# Altium schematic sheet TIDA-01349_Inverter_VISense.SchDoc: InverterPowerStage_DCVoltagePhaseCurrentSense
size 431 x 279 mm; Date: Not shown in title block; ApprovedBy: Not shown in title block; CheckedBy: Not shown in title block; Author: Not shown in title block; CompanyName: Not shown in title block; Engineer: Not shown in title block; Organization: Not shown in title block; Address1: Not shown in title block; Address2: Not shown in title block; Address3: Not shown in title block; Address4: Not shown in title block; DocumentNumber: 1; Revision: Use project parameter SCH_Rev; SheetNumber: 3; SheetTotal: 4; PageSetup: Record=PageOptions|CenterHorizontal=True|CenterVertical=True|PrintScale=1.00|XCorrection=1.00|YCorrection=1.00|PrintKind=0|BorderSize=5000000|LeftOffset=0|BottomOffset=0|Orientation=2|PaperLength=1000|PaperWidth=1000|Scale=100|PaperSource=15|PrintQuality=600|MediaType=1|DitherType=10|PaperKind=Letter|PrintScaleMode=1; CurrentTime: Not shown in title block; CurrentDate: Not shown in title block; Time: Not shown in title block; DocumentFullPathAndName: Not shown in title block; DocumentName: Not shown in title block; ModifiedDate: Not shown in title block; ImagePath: Not shown in title block
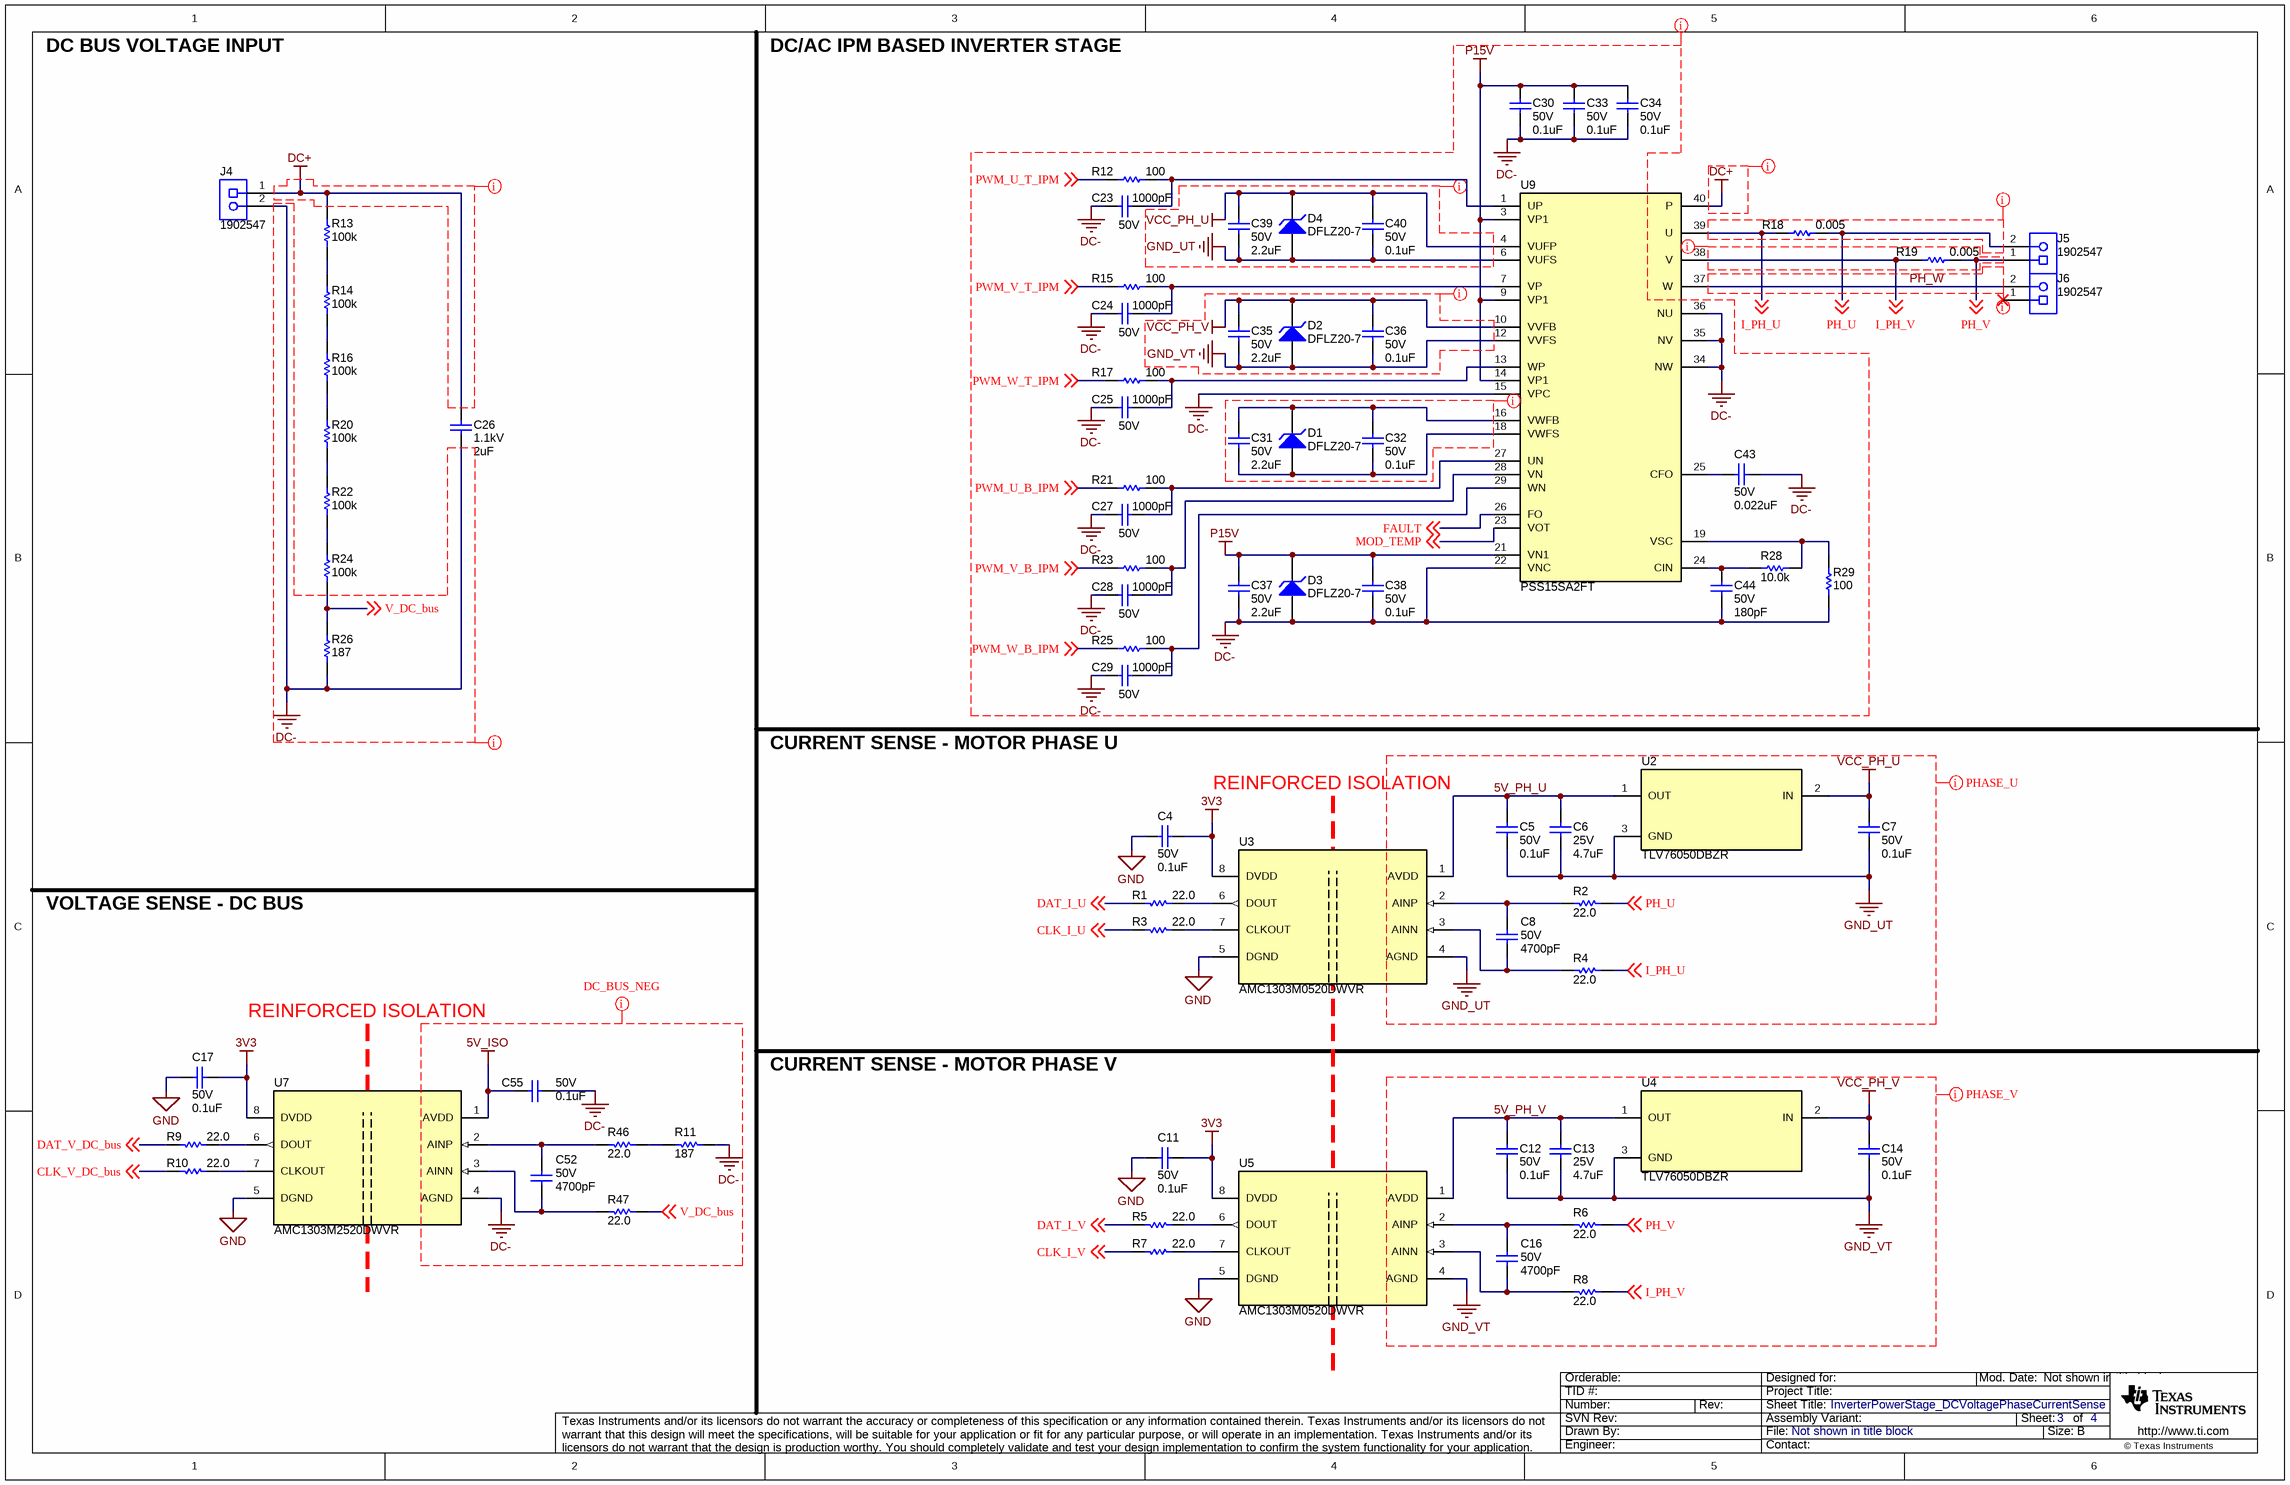
[diagram p0: TIDA-01349_Inverter_VISense.SchDoc]

## Parts
C4  VDC_V: 50V  ValueDisplayed: 0.1uF  [0603]  (hidden comment: C0603C104K5RACTU)
C5  VDC_V: 50V  ValueDisplayed: 0.1uF  [1206]  (hidden comment: C1206C104K5RACTU)
C6  VDC_V: 25V  ValueDisplayed: 4.7uF  [0805_HV]  (hidden comment: C2012X7R1E475K125AB)
C7  VDC_V: 50V  ValueDisplayed: 0.1uF  [0603]  (hidden comment: C0603C104K5RACTU)
C8  VDC_V: 50V  ValueDisplayed: 4700pF  [0603]  (hidden comment: C0603C472K5RACTU)
C11  VDC_V: 50V  ValueDisplayed: 0.1uF  [0603]  (hidden comment: C0603C104K5RACTU)
C12  VDC_V: 50V  ValueDisplayed: 0.1uF  [1206]  (hidden comment: C1206C104K5RACTU)
C13  VDC_V: 25V  ValueDisplayed: 4.7uF  [0805_HV]  (hidden comment: C2012X7R1E475K125AB)
C14  VDC_V: 50V  ValueDisplayed: 0.1uF  [0603]  (hidden comment: C0603C104K5RACTU)
C16  VDC_V: 50V  ValueDisplayed: 4700pF  [0603]  (hidden comment: C0603C472K5RACTU)
C17  VDC_V: 50V  ValueDisplayed: 0.1uF  [0603]  (hidden comment: C0603C104K5RACTU)
C23  VDC_V: 50V  ValueDisplayed: 1000pF  [0603]  (hidden comment: C0603C102J5GACTU)
C24  VDC_V: 50V  ValueDisplayed: 1000pF  [0603]  (hidden comment: C0603C102J5GACTU)
C25  VDC_V: 50V  ValueDisplayed: 1000pF  [0603]  (hidden comment: C0603C102J5GACTU)
C26  VDC_V: 1.1kV  ValueDisplayed: 2uF  [B32774_3150x2150x1250]  (hidden comment: B32774D0205K000)
C27  VDC_V: 50V  ValueDisplayed: 1000pF  [0603]  (hidden comment: C0603C102J5GACTU)
C28  VDC_V: 50V  ValueDisplayed: 1000pF  [0603]  (hidden comment: C0603C102J5GACTU)
C29  VDC_V: 50V  ValueDisplayed: 1000pF  [0603]  (hidden comment: C0603C102J5GACTU)
C30  VDC_V: 50V  ValueDisplayed: 0.1uF  [0603]  (hidden comment: C0603C104K5RACTU)
C31  VDC_V: 50V  ValueDisplayed: 2.2uF  [1206]  (hidden comment: UMK316B7225KL-T)
C32  VDC_V: 50V  ValueDisplayed: 0.1uF  [0603]  (hidden comment: C0603C104K5RACTU)
C33  VDC_V: 50V  ValueDisplayed: 0.1uF  [0603]  (hidden comment: C0603C104K5RACTU)
C34  VDC_V: 50V  ValueDisplayed: 0.1uF  [0603]  (hidden comment: C0603C104K5RACTU)
C35  VDC_V: 50V  ValueDisplayed: 2.2uF  [1206]  (hidden comment: UMK316B7225KL-T)
C36  VDC_V: 50V  ValueDisplayed: 0.1uF  [0603]  (hidden comment: C0603C104K5RACTU)
C37  VDC_V: 50V  ValueDisplayed: 2.2uF  [1206]  (hidden comment: UMK316B7225KL-T)
C38  VDC_V: 50V  ValueDisplayed: 0.1uF  [0603]  (hidden comment: C0603C104K5RACTU)
C39  VDC_V: 50V  ValueDisplayed: 2.2uF  [1206]  (hidden comment: UMK316B7225KL-T)
C40  VDC_V: 50V  ValueDisplayed: 0.1uF  [0603]  (hidden comment: C0603C104K5RACTU)
C43  VDC_V: 50V  ValueDisplayed: 0.022uF  [0603]  (hidden comment: C0603C223K5RACTU)
C44  VDC_V: 50V  ValueDisplayed: 180pF  [0603]  (hidden comment: C0603C181J5GACTU)
C52  VDC_V: 50V  ValueDisplayed: 4700pF  [0603]  (hidden comment: C0603C472K5RACTU)
C55  VDC_V: 50V  ValueDisplayed: 0.1uF  [0603]  (hidden comment: C0603C104K5RACTU)
D1  DFLZ20-7  [PowerDI123]
D2  DFLZ20-7  [PowerDI123]
D3  DFLZ20-7  [PowerDI123]
D4  DFLZ20-7  [PowerDI123]
J4  1902547  [Phoenix_1902547]
J5  1902547  [Phoenix_1902547]
J6  1902547  [Phoenix_1902547]
R1  ValueDisplayed: 22.0  [0603]  (hidden comment: RC0603FR-0722RL)
R2  ValueDisplayed: 22.0  [0603]  (hidden comment: RC0603FR-0722RL)
R3  ValueDisplayed: 22.0  [0603]  (hidden comment: RC0603FR-0722RL)
R4  ValueDisplayed: 22.0  [0603]  (hidden comment: RC0603FR-0722RL)
R5  ValueDisplayed: 22.0  [0603]  (hidden comment: RC0603FR-0722RL)
R6  ValueDisplayed: 22.0  [0603]  (hidden comment: RC0603FR-0722RL)
R7  ValueDisplayed: 22.0  [0603]  (hidden comment: RC0603FR-0722RL)
R8  ValueDisplayed: 22.0  [0603]  (hidden comment: RC0603FR-0722RL)
R9  ValueDisplayed: 22.0  [0603]  (hidden comment: RC0603FR-0722RL)
R10  ValueDisplayed: 22.0  [0603]  (hidden comment: RC0603FR-0722RL)
R11  ValueDisplayed: 187  [0603]  (hidden comment: CRCW0603187RFKEA)
R12  ValueDisplayed: 100  [0603]  (hidden comment: CRCW0603100RFKEA)
R13  ValueDisplayed: 100k  [1206]  (hidden comment: CRCW1206100KFKEA)
R14  ValueDisplayed: 100k  [1206]  (hidden comment: CRCW1206100KFKEA)
R15  ValueDisplayed: 100  [0603]  (hidden comment: CRCW0603100RFKEA)
R16  ValueDisplayed: 100k  [1206]  (hidden comment: CRCW1206100KFKEA)
R17  ValueDisplayed: 100  [0603]  (hidden comment: CRCW0603100RFKEA)
R18  ValueDisplayed: 0.005  [CSNL1206]  (hidden comment: CSNL1206FT5L00)
R19  ValueDisplayed: 0.005  [CSNL1206]  (hidden comment: CSNL1206FT5L00)
R20  ValueDisplayed: 100k  [1206]  (hidden comment: CRCW1206100KFKEA)
R21  ValueDisplayed: 100  [0603]  (hidden comment: CRCW0603100RFKEA)
R22  ValueDisplayed: 100k  [1206]  (hidden comment: CRCW1206100KFKEA)
R23  ValueDisplayed: 100  [0603]  (hidden comment: CRCW0603100RFKEA)
R24  ValueDisplayed: 100k  [1206]  (hidden comment: CRCW1206100KFKEA)
R25  ValueDisplayed: 100  [0603]  (hidden comment: CRCW0603100RFKEA)
R26  ValueDisplayed: 187  [0603]  (hidden comment: CRCW0603187RFKEA)
R28  ValueDisplayed: 10.0k  [0603]  (hidden comment: CRCW060310K0FKEA)
R29  ValueDisplayed: 100  [0603]  (hidden comment: CRCW0603100RFKEA)
R46  ValueDisplayed: 22.0  [0603]  (hidden comment: RC0603FR-0722RL)
R47  ValueDisplayed: 22.0  [0603]  (hidden comment: RC0603FR-0722RL)
U2  TLV76050DBZR  [DBZ0003A_N]
U3  AMC1303M0520DWVR  [DWV0008A]
U4  TLV76050DBZR  [DBZ0003A_N]
U5  AMC1303M0520DWVR  [DWV0008A]
U7  AMC1303M2520DWVR  [DWV0008A]
U9  PSS15SA2FT  [PSS15SA2FT]

## Nets
3V3: C4.1 C11.1 C17.1 U3.8(DVDD) U5.8(DVDD) U7.8(DVDD)
5V_ISO: C55.2 U7.1(AVDD)
DC+: C26.1 J4.1 R13.2 U9.40(P)
DC-: C23.2 C24.2 C25.2 C26.2 C27.2 C28.2 C29.2 C30.2 C33.2 C34.2 C37.2 C38.2 C43.1 C44.2 C55.1 D3.2(A) J4.2 R11.1 R26.1 R29.2 U7.4(AGND) U9.15(VPC) U9.22(VNC) U9.34(NW) U9.35(NV) U9.36(NU)
GND: C4.2 C11.2 C17.2 U3.5(DGND) U5.5(DGND) U7.5(DGND)
GND_UT: C5.1 C6.2 C7.1 C39.2 C40.2 D4.2(A) U2.3(GND) U3.4(AGND) U9.6(VUFS)
GND_VT: C12.1 C13.2 C14.1 C35.2 C36.2 D2.2(A) U4.3(GND) U5.4(AGND) U9.12(VVFS)
P15V: C30.1 C33.1 C34.1 C37.1 C38.1 D3.1(K) U9.3(VP1) U9.9(VP1) U9.14(VP1) U9.21(VN1)
VCC_PH_U: C7.2 C39.1 C40.1 D4.1(K) U2.2(IN) U9.4(VUFP)
VCC_PH_V: C14.2 C35.1 C36.1 D2.1(K) U4.2(IN) U9.10(VVFB)
5V_PH_U: C5.2 C6.1 U2.1(OUT) U3.1(AVDD)
5V_PH_V: C12.2 C13.1 U4.1(OUT) U5.1(AVDD)
CLK_I_U: R3.2 ; off-sheet CLK_I_U
CLK_I_V: R7.2 ; off-sheet CLK_I_V
CLK_V_DC_bus: R10.2 ; off-sheet CLK_V_DC_bus
DAT_I_U: R1.2 ; off-sheet DAT_I_U
DAT_I_V: R5.2 ; off-sheet DAT_I_V
DAT_V_DC_bus: R9.2 ; off-sheet DAT_V_DC_bus
FAULT: U9.26(FO) ; off-sheet FAULT
I_PH_U: R4.1 R18.1 U9.39(U) ; off-sheet I_PH_U
I_PH_V: R8.1 R19.1 U9.38(V) ; off-sheet I_PH_V
MOD_TEMP: U9.23(VOT) ; off-sheet MOD_TEMP
PH_U: J5.2 R2.1 R18.2 ; off-sheet PH_U
PH_V: J5.1 R6.1 R19.2 ; off-sheet PH_V
PH_W: J6.2 U9.37(W)
PWM_U_B_IPM: R21.1 ; off-sheet PWM_U_B_IPM
PWM_U_T_IPM: R12.1 ; off-sheet PWM_U_T_IPM
PWM_V_B_IPM: R23.1 ; off-sheet PWM_V_B_IPM
PWM_V_T_IPM: R15.1 ; off-sheet PWM_V_T_IPM
PWM_W_B_IPM: R25.1 ; off-sheet PWM_W_B_IPM
PWM_W_T_IPM: R17.1 ; off-sheet PWM_W_T_IPM
V_DC_bus: R24.1 R26.2 R47.1 ; off-sheet V_DC_bus
NetC8_1: C8.1 R2.2 U3.2(AINP)
NetC8_2: C8.2 R4.2 U3.3(AINN)
NetC16_1: C16.1 R6.2 U5.2(AINP)
NetC16_2: C16.2 R8.2 U5.3(AINN)
NetC23_1: C23.1 R12.2 U9.1(UP)
NetC24_1: C24.1 R15.2 U9.7(VP)
NetC25_1: C25.1 R17.2 U9.13(WP)
NetC27_1: C27.1 R21.2 U9.27(UN)
NetC28_1: C28.1 R23.2 U9.28(VN)
NetC29_1: C29.1 R25.2 U9.29(WN)
NetC31_1: C31.1 C32.1 D1.1(K) U9.16(VWFB)
NetC31_2: C31.2 C32.2 D1.2(A) U9.18(VWFS)
NetC43_2: C43.2 U9.25(CFO)
NetC44_1: C44.1 R28.1 U9.24(CIN)
NetC52_1: C52.1 R46.2 U7.2(AINP)
NetC52_2: C52.2 R47.2 U7.3(AINN)
NetR1_1: R1.1 U3.6(DOUT)
NetR3_1: R3.1 U3.7(CLKOUT)
NetR5_1: R5.1 U5.6(DOUT)
NetR7_1: R7.1 U5.7(CLKOUT)
NetR9_1: R9.1 U7.6(DOUT)
NetR10_1: R10.1 U7.7(CLKOUT)
NetR11_2: R11.2 R46.1
NetR13_1: R13.1 R14.2
NetR14_1: R14.1 R16.2
NetR16_1: R16.1 R20.2
NetR20_1: R20.1 R22.2
NetR22_1: R22.1 R24.2
NetR28_2: R28.2 R29.1 U9.19(VSC)

Not connected (* = marked no-connect by the designer): J6 1*

## Layout directives
net class DC_BUS_NEG: 5V_ISO, DC+, DC-, FAULT, GND_UT, GND_VT, I_PH_U, MOD_TEMP, P15V, PH_U, PWM_U_B_IPM, PWM_U_T_IPM, PWM_V_B_IPM, PWM_V_T_IPM, PWM_W_B_IPM, PWM_W_T_IPM, V_DC_bus, VCC_PH_U, VCC_PH_V
net class PHASE_U: 5V_PH_U, (no net found under the mark), DC+, DC-, FAULT, GND_UT, GND_VT, I_PH_U, MOD_TEMP, P15V, PH_U, PWM_U_B_IPM, PWM_U_T_IPM, PWM_V_B_IPM, PWM_V_T_IPM, PWM_W_B_IPM, PWM_W_T_IPM, VCC_PH_U, VCC_PH_V
net class PHASE_W: DC+, DC-, FAULT, GND_UT, GND_VT, I_PH_U, MOD_TEMP, P15V, PH_U, PH_W, PWM_U_B_IPM, PWM_U_T_IPM, PWM_V_B_IPM, PWM_V_T_IPM, PWM_W_B_IPM, PWM_W_T_IPM, VCC_PH_U, VCC_PH_V
net class PHASE_V: 5V_PH_V, (no net found under the mark), DC+, DC-, FAULT, GND_UT, GND_VT, I_PH_U, I_PH_V, MOD_TEMP, P15V, PH_U, PH_V, PWM_U_B_IPM, PWM_U_T_IPM, PWM_V_B_IPM, PWM_V_T_IPM, PWM_W_B_IPM, PWM_W_T_IPM, VCC_PH_U, VCC_PH_V
net class DC_BUS_POS: DC+, DC-, FAULT, GND_UT, GND_VT, I_PH_U, MOD_TEMP, P15V, PH_U, PWM_U_B_IPM, PWM_U_T_IPM, PWM_V_B_IPM, PWM_V_T_IPM, PWM_W_B_IPM, PWM_W_T_IPM, VCC_PH_U, VCC_PH_V

## Notes on the sheet
- DC BUS VOLTAGE INPUT
- DC/AC IPM BASED INVERTER STAGE
- CURRENT SENSE - MOTOR PHASE U
- REINFORCED ISOLATION
- VOLTAGE SENSE - DC BUS
- CURRENT SENSE - MOTOR PHASE V
- Drawn By:
- SVN Rev:
- Number:
- TID #:
- Orderable:
- Rev:
- Sheet Title:
- File:
- Project Title:
- Designed for:
- Assembly Variant:
- Mod. Date:
- Sheet:
- Size:
- of
- B
- http://www.ti.com
- Texas Instruments and/or its licensors do not warrant the accuracy or completeness of this specification or any information contained therein. Texas Instruments and/or its licensors do not warrant that this design will meet the specifications, will be suitable for your application or fit for any particular purpose, or will operate in an implementation. Texas Instruments and/or its licensors do not warrant that the design is production worthy. You should completely validate and test your design implementation to confirm the system functionality for your application.
- Engineer:
- Contact:
- © Texas Instruments

## Library data of the parts
C4 C7 C11 C14 C17 C30 C32-C34 C36 C38 C40 C55 = CMP-0006861-2: CAP, CERM, 0.1 uF, 50 V, +/- 10%, X7R, 0603; Manufacturer: Kemet; TaMin_C: -55°C; Polarized: N; SizeAreaWB_mm2: 4.68; Value1: Unknown; U/M: EA; Value: 0.1uF; TaMax_C: 125°C; SizeZ_mm: 1; SizeX_mm: 1.6; SizeY_mm: 0.8; SizeArea_mm2: 1.28; Cap_F: 100nF; AEC Category: Q200; Supplier Part Number 2: 80-C0603C104K5R; Publisher: Texas Instruments; Supplier 2: Mouser; Supplier Part Number 3: 1288255; TempCo: X7R; Supplier 3: Farnell; Published: 2008-06-19; RoHS: Y; MountType: SMT; Supplier 1: Digi-Key; PackageReference: 0603; Tolerance_%: 10%; Cap_Case: 0603; Value2: 50V; CompType: Capacitor; LatestRevisionDate: 2017-03-09; PartNumber: C0603C104K5RACTU; AEC Qualified: ?; ComponentLink1Description: Datasheet link; Supplier Part Number 1: 399-5089-1-ND; Technology: Ceramic; ComponentLink1URL: http://www.kemet.com/kemet/web/homepage/kechome.nsf/vapubfiles/F3102_Y5V.pdf/$file/F3102_Y5V.pdf
C5 C12 = CMP-0008586-2: CAP, CERM, 0.1 uF, 50 V, +/- 10%, X7R, 1206; Manufacturer: Kemet; TaMin_C: -55°C; ESR_ohm: 0.059; Polarized: N; SizeAreaWB_mm2: 10.92; Value1: 0.059 ohm; U/M: EA; Value: 0.1uF; TaMax_C: 125°C; SizeZ_mm: 1.35; SizeX_mm: 3.2; SizeY_mm: 1.6; SizeArea_mm2: 5.12; Cap_F: 100nF; IRMS_A: 1.2A; AEC Category: Q200; Supplier Part Number 2: 70K9167; Publisher: Texas Instruments; Supplier 2: Newark; Supplier Part Number 3: 80-C1206C104K5R; TempCo: X7R; Supplier 3: Mouser; Published: 2008-06-19; RoHS: Y; MountType: SMT; Supplier 1: Digi-Key; PackageReference: 1206; Tolerance_%: 10%; Cap_Case: 1206; Value2: 50V; CompType: Capacitor; LatestRevisionDate: 2017-03-09; PartNumber: C1206C104K5RACTU; AEC Qualified: ?; ComponentLink1Description: Datasheet link; Supplier Part Number 1: 399-1249-1-ND; Technology: Ceramic; ComponentLink1URL: http://www.kemet.com/kemet/web/homepage/kechome.nsf/file/Partial%20Copy%20-%20Ceramic%20Surface%20Mount%20Capacitors/$file/F3102_CE.pdf
C6 C13 = CMP-0007870-2: CAP, CERM, 4.7 uF, 25 V, +/- 10%, X7R, 0805; Manufacturer: TDK; TaMin_C: -55°C; Polarized: N; SizeAreaWB_mm2: 6.75; Value1: Unknown; U/M: EA; Value: 4.7uF; TaMax_C: 125°C; SizeZ_mm: 1.45; SizeX_mm: 2; SizeY_mm: 1.25; Cap_Case: 0805; SizeArea_mm2: 2.5; Cap_F: 4.7µF; AEC Category: Q200; Supplier Part Number 2: 04X3287; Publisher: Texas Instruments; Supplier 2: Newark; Supplier Part Number 3: 810-C2012X7R1E475K; TempCo: X7R; Supplier 3: Mouser; Published: 2008-06-19; RoHS: Y; MountType: SMT; Supplier 1: Digi-Key; PackageReference: 0805; Tolerance_%: 10%; Value2: 25V; CompType: Capacitor; LatestRevisionDate: 2017-03-09; PartNumber: C2012X7R1E475K125AB; AEC Qualified: N; ComponentLink1Description: Datasheet link; AEC Grade: N/A; Supplier Part Number 1: 445-5972-1-ND; Technology: Ceramic; ComponentLink1URL: https://product.tdk.com/info/en/catalog/datasheets/mlcc_commercial_general_en.pdf
C8 C16 C52 = CMP-0006943-2: CAP, CERM, 4700 pF, 50 V, +/- 10%, X7R, 0603; Manufacturer: Kemet; TaMin_C: -55°C; Polarized: N; SizeAreaWB_mm2: 4.68; Value1: Unknown; U/M: EA; Value: 4700pF; TaMax_C: 125°C; SizeZ_mm: 1; SizeX_mm: 1.6; SizeY_mm: 0.8; SizeArea_mm2: 1.28; Cap_F: 4.7nF; AEC Category: Q200; Supplier Part Number 2: 80-C0603C472K5R; Publisher: Texas Instruments; Supplier 2: Mouser; Supplier Part Number 3: 1414642; TempCo: X7R; Supplier 3: Farnell; Published: 2008-06-19; RoHS: Y; MountType: SMT; Supplier 1: Digi-Key; PackageReference: 0603; Tolerance_%: 10%; Cap_Case: 0603; Value2: 50V; CompType: Capacitor; LatestRevisionDate: 2017-03-09; PartNumber: C0603C472K5RACTU; AEC Qualified: ?; ComponentLink1Description: Datasheet link; Supplier Part Number 1: 399-1087-1-ND; Technology: Ceramic; ComponentLink1URL: http://www.kemet.com/kemet/web/homepage/kechome.nsf/vapubfiles/F3102_Y5V.pdf/$file/F3102_Y5V.pdf
C23-C25 C27-C29 = CMP-0006843-2: CAP, CERM, 1000 pF, 50 V, +/- 5%, C0G/NP0, 0603; Manufacturer: Kemet; TaMin_C: -55°C; Polarized: N; SizeAreaWB_mm2: 4.68; Value1: Unknown; U/M: EA; Value: 1000pF; TaMax_C: 125°C; SizeZ_mm: 1; SizeX_mm: 1.6; SizeY_mm: 0.8; SizeArea_mm2: 1.28; Cap_F: 1nF; AEC Category: Q200; Supplier Part Number 2: 80-C0603C102J5G; Publisher: Texas Instruments; Supplier 2: Mouser; Supplier Part Number 3: 1414605; TempCo: C0G/NP0; Supplier 3: Farnell; Published: 2008-06-19; RoHS: Y; MountType: SMT; Supplier 1: Digi-Key; PackageReference: 0603; Tolerance_%: 5%; Cap_Case: 0603; Value2: 50V; CompType: Capacitor; LatestRevisionDate: 2017-03-09; PartNumber: C0603C102J5GACTU; AEC Qualified: ?; ComponentLink1Description: Datasheet link; Supplier Part Number 1: 399-3293-1-ND; Technology: Ceramic; ComponentLink1URL: http://www.kemet.com/kemet/web/homepage/kechome.nsf/vapubfiles/F3102_Y5V.pdf/$file/F3102_Y5V.pdf
C26 = CMP-0012356-2: CAP, Film, 2 uF, 1100 V, +/- 10%, 0.011 ohm, TH; Manufacturer: TDK; TaMin_C: -40°C; ESR_ohm: 0.011; Polarized: N; SizeAreaWB_mm2: 485.75; U/M: EA; Value: 2uF; TaMax_C: 105°C; SizeZ_mm: 21.5; SizeX_mm: 31.5; SizeY_mm: 12.5; Cap_Case: 31.5x21.5x12.5mm; Value2: 1100V; SizeArea_mm2: 393.75; Cap_F: 2µF; IRMS_A: 3.5A; AEC Category: Q200; Supplier Part Number 2: 42Y0105; Publisher: Texas Instruments; Supplier 2: Newark; Supplier Part Number 3: 871-B32774D205K; Supplier 3: Mouser; RoHS: Y; Value1: 0.011 ohm; MountType: TH; Supplier 1: Digi-Key; PackageReference: 31.5x21.5x12.5mm; Tolerance_%: 10%; CompType: Capacitor; LatestRevisionDate: 2017-03-09; PartNumber: B32774D0205K000; AEC Qualified: N; Series: B32774; ComponentLink1Description: Datasheet link; AEC Grade: N/A; Supplier Part Number 1: 495-4482-ND; Technology: Film; ComponentLink1URL: https://product.tdk.com/search-template/en/documents/data_sheet/20/20/db/fc_2009/MKP_B32774_778.pdf
C31 C37 C39 = CMP-0009028-2: CAP, CERM, 2.2 uF, 50 V, +/- 10%, X7R, 1206; Manufacturer: Taiyo Yuden; TaMin_C: -55°C; Polarized: N; SizeAreaWB_mm2: 10.92; Value1: Unknown; U/M: EA; Value: 2.2uF; TaMax_C: 125°C; SizeZ_mm: 1.35; SizeX_mm: 3.2; SizeY_mm: 1.6; SizeArea_mm2: 5.12; Cap_F: 2.2µF; AEC Category: Q200; Supplier Part Number 2: 47T1713; Publisher: Texas Instruments; Supplier 2: Newark; Supplier Part Number 3: 963-UMK316B7225KL-T; TempCo: X7R; Supplier 3: Mouser; Published: 2008-06-19; RoHS: Y; MountType: SMT; Supplier 1: Digi-Key; PackageReference: 1206; Tolerance_%: 10%; Cap_Case: 1206; Value2: 50V; CompType: Capacitor; LatestRevisionDate: 2017-03-09; PartNumber: UMK316B7225KL-T; AEC Qualified: ?; ComponentLink1Description: Datasheet link; Supplier Part Number 1: 587-2911-1-ND; Technology: Ceramic; ComponentLink1URL: http://www.yuden.co.jp/or/product/category/capacitor/UMK316B7225KL-T.pdf
C35 = CMP-0009028-2: CAP, CERM, 2.2 uF, 50 V, +/- 10%, X7R, 1206; Manufacturer: Taiyo Yuden; TaMin_C: -55°C; Polarized: N; SizeAreaWB_mm2: 10.92; Value1: Unknown; U/M: EA; Value: 2.2uF; TaMax_C: 125°C; SizeZ_mm: 1.35; SizeX_mm: 3.2; SizeY_mm: 1.6; SizeArea_mm2: 5.12; CompType: Capacitor; Cap_F: 2.2µF; AEC Category: Q200; Supplier Part Number 2: 47T1713; Publisher: Texas Instruments; Supplier 2: Newark; Supplier Part Number 3: 963-UMK316B7225KL-T; TempCo: X7R; Supplier 3: Mouser; Published: 2008-06-19; RoHS: Y; MountType: SMT; Supplier 1: Digi-Key; PackageReference: 1206; Tolerance_%: 10%; Cap_Case: 1206; Value2: 50V; LatestRevisionDate: 2017-03-09; PartNumber: UMK316B7225KL-T; AEC Qualified: ?; ComponentLink1Description: Datasheet link; Supplier Part Number 1: 587-2911-1-ND; Technology: Ceramic; ComponentLink1URL: http://www.yuden.co.jp/or/product/category/capacitor/UMK316B7225KL-T.pdf
C43 = CMP-0006901-2: CAP, CERM, 0.022 uF, 50 V, +/- 10%, X7R, 0603; Manufacturer: Kemet; TaMin_C: -55°C; Polarized: N; Value1: Unknown; U/M: EA; TaMax_C: 125°C; SizeAreaWB_mm2: 4.68; SizeZ_mm: 1; SizeX_mm: 1.6; SizeY_mm: 0.8; SizeArea_mm2: 1.28; Cap_F: 22nF; AEC Category: Q200; Supplier Part Number 2: 80-C0603C223K5R; Publisher: Texas Instruments; Supplier 2: Mouser; Supplier Part Number 3: 1414625; TempCo: X7R; Supplier 3: Farnell; Published: 2008-06-19; RoHS: Y; MountType: SMT; Value: 0.022uF; Supplier 1: Digi-Key; PackageReference: 0603; Tolerance_%: 10%; Cap_Case: 0603; Value2: 50V; CompType: Capacitor; LatestRevisionDate: 2017-03-09; PartNumber: C0603C223K5RACTU; AEC Qualified: ?; ComponentLink1Description: Datasheet link; Supplier Part Number 1: 399-1280-1-ND; Technology: Ceramic; ComponentLink1URL: http://www.kemet.com/kemet/web/homepage/kechome.nsf/vapubfiles/F3102_Y5V.pdf/$file/F3102_Y5V.pdf
C44 = CMP-0006888-2: CAP, CERM, 180 pF, 50 V, +/- 5%, C0G/NP0, 0603; Manufacturer: Kemet; TaMin_C: -55°C; Polarized: N; SizeAreaWB_mm2: 4.68; Value1: Unknown; U/M: EA; Value: 180pF; TaMax_C: 125°C; SizeZ_mm: 1; SizeX_mm: 1.6; SizeY_mm: 0.8; SizeArea_mm2: 1.28; AEC Category: Q200; Supplier Part Number 2: 80-C0603C181J5G; Publisher: Texas Instruments; Supplier 2: Mouser; Supplier Part Number 3: 1414621; TempCo: C0G/NP0; Supplier 3: Farnell; Published: 2008-06-19; RoHS: Y; MountType: SMT; Supplier 1: Digi-Key; PackageReference: 0603; Tolerance_%: 5%; Cap_Case: 0603; Value2: 50V; CompType: Capacitor; LatestRevisionDate: 2017-03-09; PartNumber: C0603C181J5GACTU; AEC Qualified: ?; Cap_F: 180pF; ComponentLink1Description: Datasheet link; Supplier Part Number 1: 399-1064-1-ND; Technology: Ceramic; ComponentLink1URL: http://www.kemet.com/kemet/web/homepage/kechome.nsf/vapubfiles/F3102_Y5V.pdf/$file/F3102_Y5V.pdf
D1-D4 = CMP-0005414-2: Diode, Zener, 20 V, 1 W, PowerDI123; Manufacturer: Diodes Inc.; Power_W: 1W; SizeAreaWB_mm2: 13.066; Vz_V: 20V; RJA_CperW: 110; U/M: EA; Value: 20V; SizeZ_mm: 0.98; SizeX_mm: 3.7; SizeY_mm: 1.78; SizeArea_mm2: 6.586; AEC Category: Q101; Supplier Part Number 2: 621-DFLZ20-7; Publisher: Texas Instruments; Supplier 2: Mouser; Published: 2008-10-08; RoHS: Y; Value1: 1W; MountType: SMT; Supplier 1: Digi-Key; LatestRevisionNote: Updated Supplier Data; PackageReference: PowerDI123; CompType: Zener; LatestRevisionDate: 2017-03-09; PartNumber: DFLZ20-7; AEC Qualified: ?; ComponentLink1Description: Datasheet link; Supplier Part Number 1: DFLZ20DICT-ND; ComponentLink1URL: http://www.diodes.com/datasheets/ds30464.pdf
J4-J6 = CMP-0055527-1: Terminal Block, 9.52mm, 2x1, R/A, TH; Manufacturer: Phoenix Contact; Cert_VDE: Y; CNHeader: FALSE; Current_A: 32A; Gender: Female; Voltage_V: 1kV; Row_Count: 1; Pitch_mm: 9.52; CT: TRUE; ComponentLink1URL: https://www.phoenixcontact.com/online/portal/in?uri=pxc-oc-itemdetail:pid=1902547&library=inen&tab=1&requestType=product&product; Supplier Part Number 2: 651-1902547; Publisher: Texas Instruments; Supplier 2: Mouser; Color: Green; RoHS: Y; MountType: TH; Supplier 1: Digi-Key; PackageReference: Terminal Block, 2x1, Pitch 9.52mm; PinCount: 2; CompType: Terminal Block; LatestRevisionDate: 26/05/2017; PartNumber: 1902547; Orientation: R/A; ComponentLink1Description: Datasheet URL; Supplier Part Number 1: 277-5951-ND; Cert_UL: Y
R1-R10 R46 R47 = CMP-0022928-1: RES, 22.0, 1%, 0.1 W, 0603; Manufacturer: Yageo America; Power_W: 100mW; TempCo: 200 ppm/C; Value_Code: 22R0; U/M: EA; Value: 22.0; Res_ohm: 22; SizeX_mm: 1.6; SizeY_mm: 0.8; SizeZ_mm: 1; Value2: 0.1W; SizeArea_mm2: 1.28; VDC_V: 150V; AEC Category: Q200; ComponentLink1URL: http://www.yageo.com/pdf/Pu-RC0603_51_PbFree_L_2.pdf; Supplier Part Number 2: 603-RC0603FR-0722RL; Publisher: Texas Instruments; Supplier 2: Mouser; Supplier Part Number 3: 9238280; Supplier 3: Farnell; Published: 2008-06-26; RoHS: Y; Value1: 1%; MountType: SMT; Supplier 1: Digi-Key; PackageReference: 0603; Tolerance_%: 1%; CompType: Resistor; LatestRevisionDate: 2017-03-09; PartNumber: RC0603FR-0722RL; AEC Qualified: ?; ComponentLink1Description: Datasheet link; Supplier Part Number 1: 311-22.0HRCT-ND; Technology: Thick Film
R11 R26 = CMP-0022096-3: RES, 187, 1%, 0.1 W, 0603; Manufacturer: Vishay-Dale; Power_W: 100mW; TempCo: 100 ppm/C; Value_Code: 187R; U/M: EA; Value: 187; EIA_Code: E96; SizeX_mm: 1.6; SizeY_mm: 0.8; SizeZ_mm: 1; Value2: 0.1W; SizeArea_mm2: 1.28; VDC_V: 75V; AEC Category: Q200; Supplier Part Number 2: 71-CRCW0603-187-E3; Publisher: Texas Instruments; Supplier 2: Mouser; Supplier Part Number 3: 1897290; Supplier 3: Farnell; Published: 2008-06-26; RoHS: Y; Value1: 1%; MountType: SMT; Supplier 1: Digi-Key; PackageReference: 0603; Tolerance_%: 1%; Res_ohm: 187; CompType: Resistor; LatestRevisionDate: 2017-03-09; PartNumber: CRCW0603187RFKEA; AEC Qualified: ?; ComponentLink1Description: Datasheet link; Supplier Part Number 1: 541-187HCT-ND; Technology: Thick Film; ComponentLink1URL: http://www.vishay.com/docs/20035/dcrcwe3.pdf
R12 R15 R17 R21 R23 R25 R29 = CMP-0021991-2: RES, 100, 1%, 0.1 W, 0603; Manufacturer: Vishay-Dale; Power_W: 100mW; TempCo: 100 ppm/C; Value_Code: 100R; U/M: EA; Value: 100; EIA_Code: E96; SizeX_mm: 1.6; SizeY_mm: 0.8; SizeZ_mm: 1; Value2: 0.1W; SizeArea_mm2: 1.28; VDC_V: 75V; AEC Category: Q200; Supplier Part Number 2: 52K8078; Publisher: Texas Instruments; Supplier 2: Newark; Supplier Part Number 3: 71-CRCW0603-100-E3; Supplier 3: Mouser; Published: 2008-06-26; RoHS: Y; Value1: 1%; MountType: SMT; Supplier 1: Digi-Key; PackageReference: 0603; Tolerance_%: 1%; Res_ohm: 100; CompType: Resistor; LatestRevisionDate: 2017-03-09; PartNumber: CRCW0603100RFKEA; AEC Qualified: ?; ComponentLink1Description: Datasheet link; Supplier Part Number 1: 541-100HCT-ND; Technology: Thick Film; ComponentLink1URL: http://www.vishay.com/docs/20035/dcrcwe3.pdf
R13 R14 R16 R20 R22 R24 = CMP-0016568-2: RES, 100 k, 1%, 0.25 W, 1206; Manufacturer: Vishay-Dale; Power_W: 250mW; TempCo: 100 ppm/C; U/M: EA; Value: 100k; EIA_Code: E96; SizeX_mm: 3.2; SizeY_mm: 1.6; SizeZ_mm: 1.35; Value2: 0.25W; SizeArea_mm2: 5.12; VDC_V: 200V; AEC Category: Q200; Supplier Part Number 2: 53K1920; Publisher: Texas Instruments; Supplier 2: Newark; Supplier Part Number 3: 71-CRCW1206-100K-E3; Supplier 3: Mouser; Published: 2008-06-26; Value_Code: 100k; RoHS: Y; Value1: 1%; MountType: SMT; Supplier 1: Digi-Key; PackageReference: 1206; Tolerance_%: 1%; Res_ohm: 100k; CompType: Resistor; LatestRevisionDate: 2017-03-09; PartNumber: CRCW1206100KFKEA; AEC Qualified: ?; ComponentLink1Description: Datasheet link; Supplier Part Number 1: 541-100KFCT-ND; Technology: Thick Film; ComponentLink1URL: http://www.vishay.com/docs/20035/dcrcwe3.pdf
R18 R19 = CMP-0065336-2: RES, 0.005, 1%, 1 W, 1206; Manufacturer: Stackpole Electronics Inc; Power_W: 1W; TempCo: 50 ppm/C; Value_Code: 5L000; U/M: EA; Value: 0.005; EIA_Code: E96; Res_ohm: 5m; SizeX_mm: 3.2; SizeY_mm: 1.6; SizeZ_mm: 0.9; SizeArea_mm2: 5.12; AEC Qualified: N; AEC Category: Q200; Publisher: Texas Instruments; Published: 2008-06-26; RoHS: Y; Value1: 1%; MountType: SMT; Supplier 1: Digi-Key; PackageReference: 1206; Tolerance_%: 1%; Value2: 1W; CompType: Resistor; LatestRevisionDate: 2017-06-05; PartNumber: CSNL1206FT5L00; ComponentLink1Description: Datasheet link; AEC Grade: N/A; Supplier Part Number 1: CSNL1206FT5L00CT-ND; Technology: Metal Foil; ComponentLink1URL: https://www.seielect.com/Catalog/SEI-csnl.pdf
R28 = CMP-0021998-2: RES, 10.0 k, 1%, 0.1 W, 0603; Manufacturer: Vishay-Dale; Power_W: 100mW; TempCo: 100 ppm/C; Value_Code: 10k0; U/M: EA; Value: 10.0k; EIA_Code: E96; Res_ohm: 10k; SizeX_mm: 1.6; SizeY_mm: 0.8; SizeZ_mm: 1; Value2: 0.1W; SizeArea_mm2: 1.28; VDC_V: 75V; AEC Category: Q200; Supplier Part Number 2: 52K8062; Publisher: Texas Instruments; Supplier 2: Newark; Supplier Part Number 3: 71-CRCW0603-10K-E3; Supplier 3: Mouser; Published: 2008-06-26; RoHS: Y; Value1: 1%; MountType: SMT; Supplier 1: Digi-Key; PackageReference: 0603; Tolerance_%: 1%; CompType: Resistor; LatestRevisionDate: 2017-03-09; PartNumber: CRCW060310K0FKEA; AEC Qualified: ?; ComponentLink1Description: Datasheet link; Supplier Part Number 1: 541-10.0KHCT-ND; Technology: Thick Film; ComponentLink1URL: http://www.vishay.com/docs/20035/dcrcwe3.pdf
U2 U4 = CMP-0074892-1: 100-mA, 30-V, Fixed-Output, Linear-Voltage Regulator, DBZ0003A (SOT-23-3); Alternate PartNumber: TLV76050DBZT; Alternate Manufacturer: Texas Instruments; SizeAreaWB_mm2: 14.0; SizeZ_mm: 1.12; SizeX_mm: 2.5; SizeY_mm: 3.0; SizeArea_mm2: 7.5; CompType: IC; AEC Qualified: N; AEC Category: Q200; ComponentLink1URL: http://www.ti.com/lit/ds/symlink/tlv760.pdf; PackageDescription: SOT-23-3; RoHS: Y; MountType: SMT; ComponentLink2URL: http://www.ti.com/product/tlv760; ComponentLink2Description: Product Folder; Manufacturer: Texas Instruments; PackageReference: DBZ0003A; PartNumber: TLV76050DBZR; ComponentLink1Description: Datasheet Link
U3 U5 = CMP-0078157-2: Small Reinforced Isolated Modulator With +/-50mV Input, Internal Clock, and CMOS Interface, DWV0008A (SOIC-8); Alternate Manufacturer: Texas Instruments; SizeAreaWB_mm2: 105.975; SizeZ_mm: 2.8; SizeX_mm: 11.5; SizeY_mm: 5.85; SizeArea_mm2: 67.275; CompType: IC; AEC Qualified: N; AEC Category: Q200; ComponentLink1URL: http://www.ti.com/lit/ds/symlink/amc1303m0520.pdf; Alternate PartNumber: AMC1303M0520DWV; PackageDescription: SOIC-8; RoHS: Y; MountType: SMT; ComponentLink2URL: http://www.ti.com/product/amc1303m0520; ComponentLink2Description: Product Folder; Manufacturer: Texas Instruments; PackageReference: DWV0008A; PartNumber: AMC1303M0520DWVR; ComponentLink1Description: Datasheet Link
U7 = CMP-0078168-2: Small Reinforced Isolated Modulator With +/-250mV Input, Internal Clock, and CMOS Interface, DWV0008A (SOIC-8); Alternate Manufacturer: Texas Instruments; SizeAreaWB_mm2: 105.975; SizeZ_mm: 2.8; SizeX_mm: 11.5; SizeY_mm: 5.85; SizeArea_mm2: 67.275; CompType: IC; AEC Qualified: N; AEC Category: Q200; ComponentLink1URL: http://www.ti.com/lit/ds/symlink/amc1303m2520.pdf; Alternate PartNumber: AMC1303M2520DWV; PackageDescription: SOIC-8; RoHS: Y; MountType: SMT; ComponentLink2URL: http://www.ti.com/product/amc1303m2520; ComponentLink2Description: Product Folder; Manufacturer: Texas Instruments; PackageReference: DWV0008A; PartNumber: AMC1303M2520DWVR; ComponentLink1Description: Datasheet Link
U9 = CMP-0077821-1: Dual-In-Line Package Intelligent Power Module, TH; Manufacturer: Mitsubishi; SizeArea_mm2: 2915.1; SizeAreaWB_mm2: 3150.9; SizeZ_mm: 8.0; SizeY_mm: 79.0; SizeX_mm: 36.9; PartNumber: PSS15SA2FT; Publisher: Texas Instruments; PackageReference: 79x31mm; Supplier Part Number 1: 55Y0369; LatestRevisionDate: 2017-09-19; ComponentLink1Description: Datasheet URL; ComponentLink1URL: http://www.mitsubishielectric.com/semiconductors/content/product/powermodule/dipipm/version6/pss15sa2ft_e.pdf; MountType: TH; Supplier 1: Newark; RoHS: Y